# Altium schematic sheet FPGA_RGMII_Misc.SchDoc
size A3
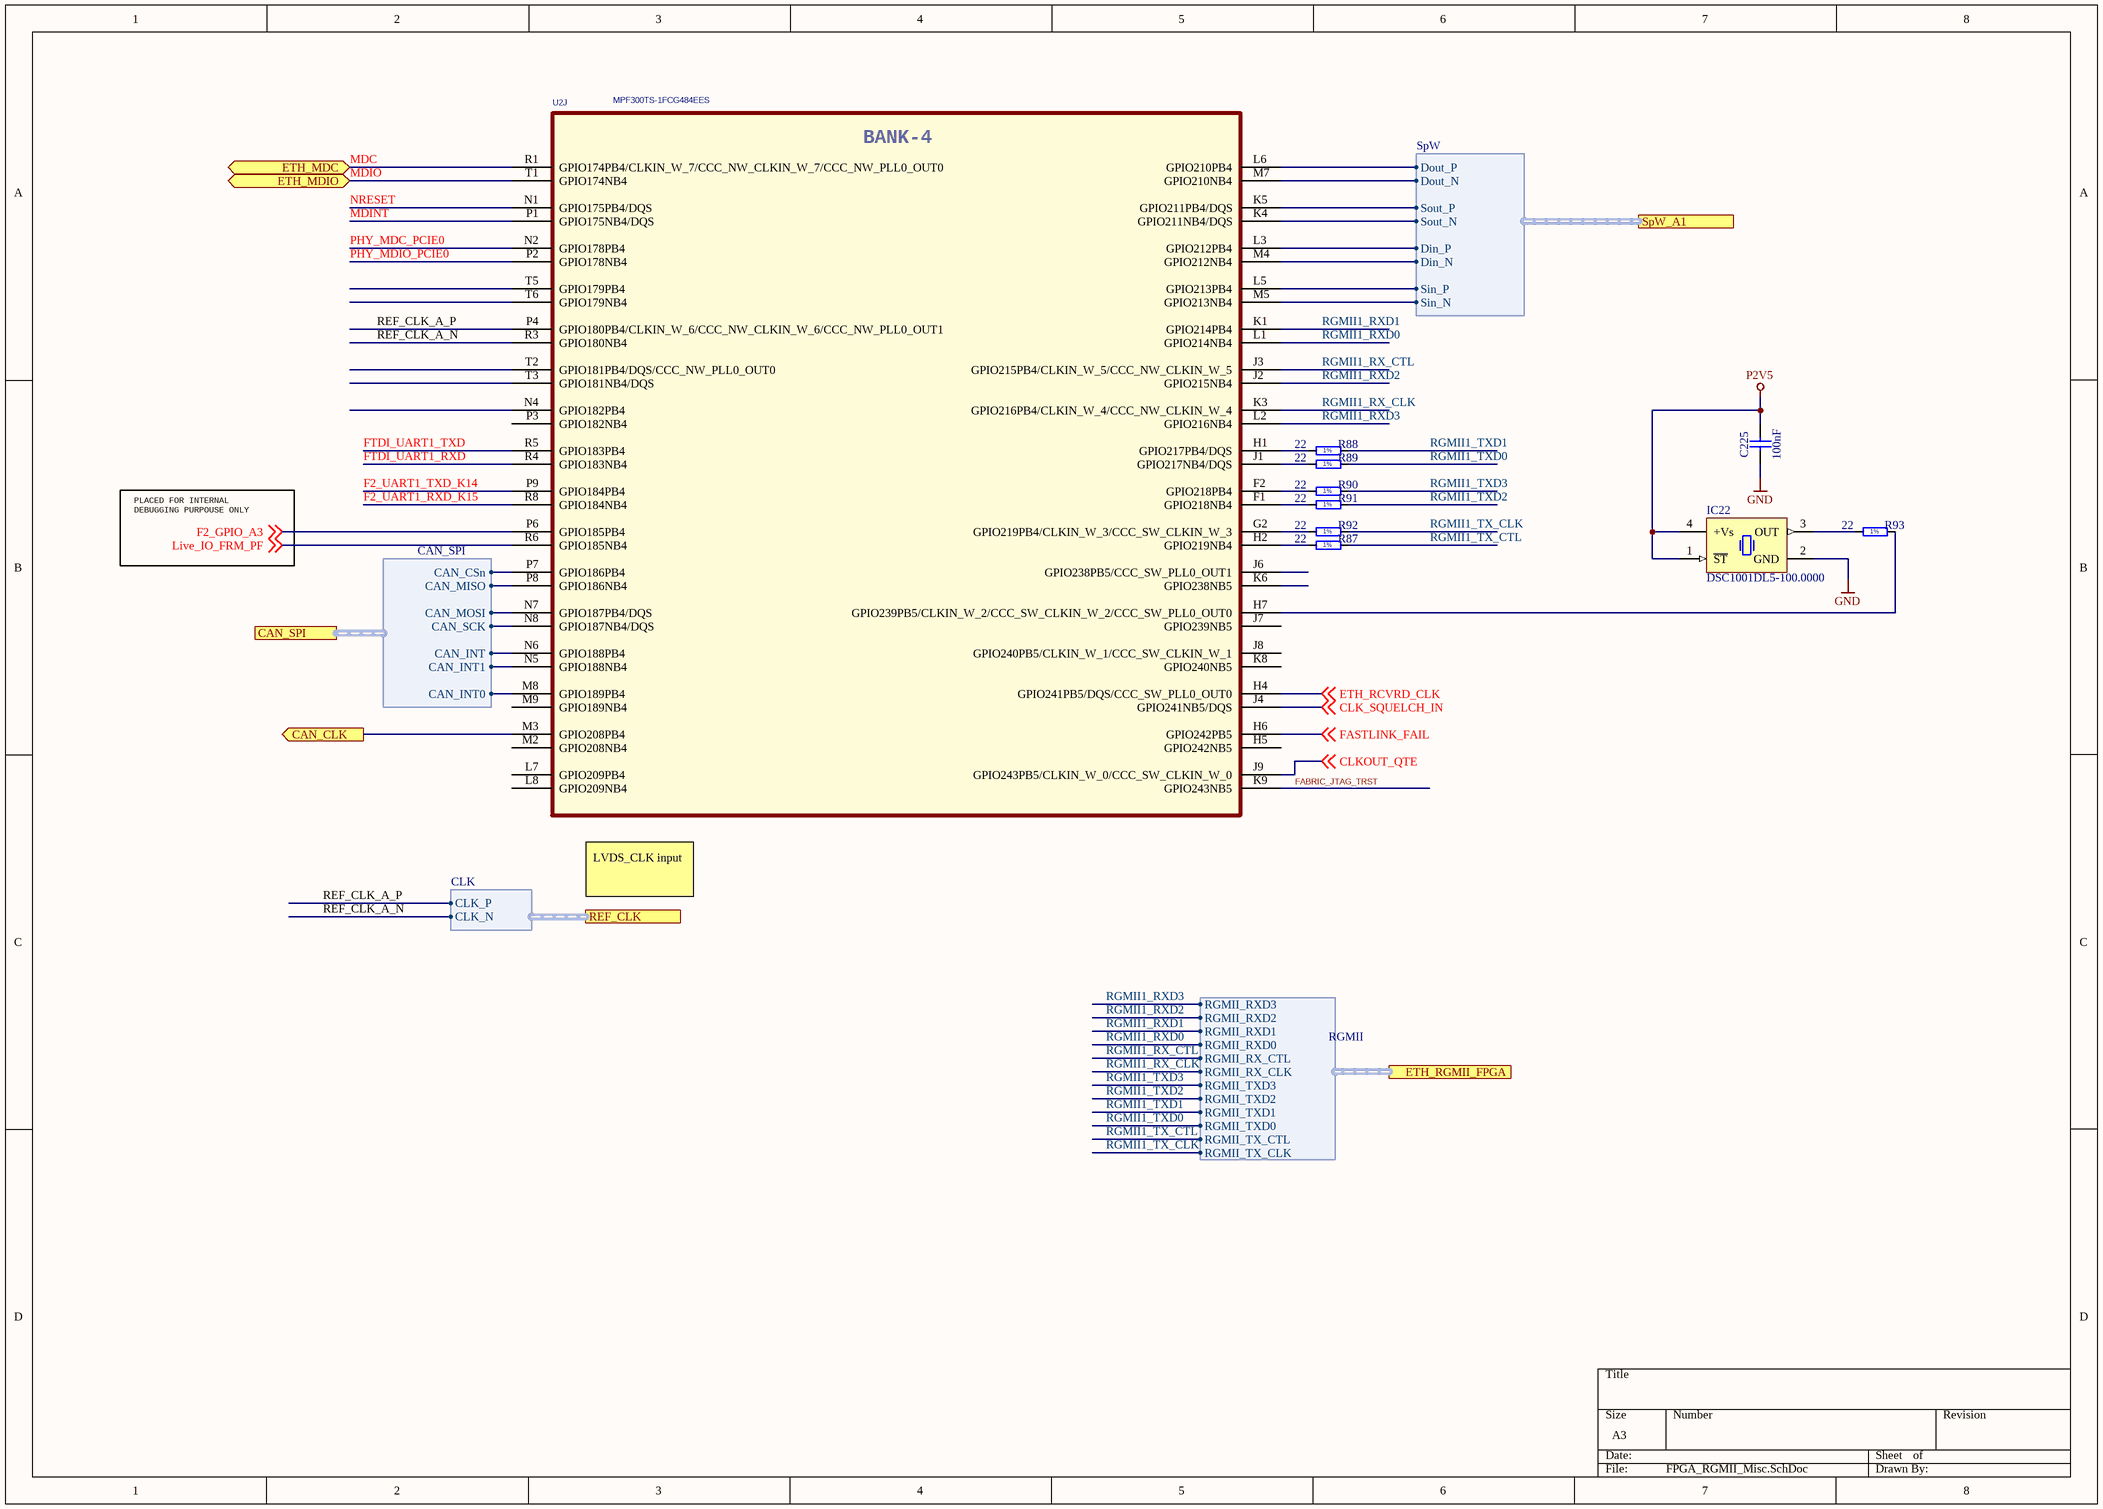
[diagram p0: FPGA_RGMII_Misc.SchDoc]

## Parts
C225  100nF  [CAPC0603X33N]
IC22  DSC1001DL5-100.0000  [OSC_MICREL_2520]
R87  22  [RESC1005X40N]
R88  22  [RESC1005X40N]
R89  22  [RESC1005X40N]
R90  22  [RESC1005X40N]
R91  22  [RESC1005X40N]
R92  22  [RESC1005X40N]
R93  22  [RESC1005X40N]
U2  MPF300TS-1FCG484EES  [BGA484C100P22X22_2300X2300X320]  (part J of 11)

## Ports
CAN_CLK (out), CAN_SPI (harness CAN_SPI), ETH_MDC (bidir), ETH_MDIO (bidir), ETH_RGMII_FPGA (harness RGMII), REF_CLK (harness CLK), SpW_A1 (harness SpW)

## Harnesses
RGMII: RGMII_RXD3, RGMII_RXD2, RGMII_RXD1, RGMII_RXD0, RGMII_RX_CTL, RGMII_RX_CLK, RGMII_TX_CLK, RGMII_TX_CTL, RGMII_TXD3, RGMII_TXD2, RGMII_TXD1, RGMII_TXD0
SpW: Sout_P, Sout_N, Dout_P, Dout_N, Sin_P, Sin_N, Din_P, Din_N
CLK: CLK_P, CLK_N
CAN_SPI: CAN_INT1, CAN_INT, CAN_INT0, CAN_SCK, CAN_MOSI, CAN_MISO, CAN_CSn

## Nets
GND: C225.1 IC22.2(GND)
P2V5: C225.2 IC22.1(~{ST}) IC22.4(+Vs)
CAN_CLK: U2.M3(GPIO208PB4) ; port CAN_CLK
CLK_SQUELCH_IN: U2.J4(GPIO241NB5/DQS) ; off-sheet CLK_SQUELCH_IN
CLKOUT_QTE: U2.J9(GPIO243PB5/CLKIN_W_0/CCC_SW_CLKIN_W_0) ; off-sheet CLKOUT_QTE
ETH_RCVRD_CLK: U2.H4(GPIO241PB5/DQS/CCC_SW_PLL0_OUT0) ; off-sheet ETH_RCVRD_CLK
F2_GPIO_A3: U2.P6(GPIO185PB4) ; off-sheet F2_GPIO_A3
F2_UART1_RXD_K15: U2.R8(GPIO184NB4)
F2_UART1_TXD_K14: U2.P9(GPIO184PB4)
FABRIC_JTAG_TRST: U2.K9(GPIO243NB5)
FASTLINK_FAIL: U2.H6(GPIO242PB5) ; off-sheet FASTLINK_FAIL
FTDI_UART1_RXD: U2.R4(GPIO183NB4)
FTDI_UART1_TXD: U2.R5(GPIO183PB4)
Live_IO_FRM_PF: U2.R6(GPIO185NB4) ; off-sheet Live_IO_FRM_PF
MDC: U2.R1(GPIO174PB4/CLKIN_W_7/CCC_NW_CLKIN_W_7/CCC_NW_PLL0_OUT0) ; port ETH_MDC
MDINT: U2.P1(GPIO175NB4/DQS)
MDIO: U2.T1(GPIO174NB4) ; port ETH_MDIO
NRESET: U2.N1(GPIO175PB4/DQS)
PHY_MDC_PCIE0: U2.N2(GPIO178PB4)
PHY_MDIO_PCIE0: U2.P2(GPIO178NB4)
REF_CLK_A_N: U2.R3(GPIO180NB4) ; port REF_CLK.CLK_N
REF_CLK_A_P: U2.P4(GPIO180PB4/CLKIN_W_6/CCC_NW_CLKIN_W_6/CCC_NW_PLL0_OUT1) ; port REF_CLK.CLK_P
RGMII1_RX_CLK: U2.K3(GPIO216PB4/CLKIN_W_4/CCC_NW_CLKIN_W_4) ; port ETH_RGMII_FPGA.RGMII_RX_CLK
RGMII1_RX_CTL: U2.J3(GPIO215PB4/CLKIN_W_5/CCC_NW_CLKIN_W_5) ; port ETH_RGMII_FPGA.RGMII_RX_CTL
RGMII1_RXD0: U2.L1(GPIO214NB4) ; port ETH_RGMII_FPGA.RGMII_RXD0
RGMII1_RXD1: U2.K1(GPIO214PB4) ; port ETH_RGMII_FPGA.RGMII_RXD1
RGMII1_RXD2: U2.J2(GPIO215NB4) ; port ETH_RGMII_FPGA.RGMII_RXD2
RGMII1_RXD3: U2.L2(GPIO216NB4) ; port ETH_RGMII_FPGA.RGMII_RXD3
RGMII1_TX_CLK: R92.2 ; port ETH_RGMII_FPGA.RGMII_TX_CLK
RGMII1_TX_CTL: R87.2 ; port ETH_RGMII_FPGA.RGMII_TX_CTL
RGMII1_TXD0: R89.2 ; port ETH_RGMII_FPGA.RGMII_TXD0
RGMII1_TXD1: R88.2 ; port ETH_RGMII_FPGA.RGMII_TXD1
RGMII1_TXD2: R91.2 ; port ETH_RGMII_FPGA.RGMII_TXD2
RGMII1_TXD3: R90.2 ; port ETH_RGMII_FPGA.RGMII_TXD3
NetIC22_3: IC22.3(OUT) R93.1
NetR87_1: R87.1 U2.H2(GPIO219NB4)
NetR88_1: R88.1 U2.H1(GPIO217PB4/DQS)
NetR89_1: R89.1 U2.J1(GPIO217NB4/DQS)
NetR90_1: R90.1 U2.F2(GPIO218PB4)
NetR91_1: R91.1 U2.F1(GPIO218NB4)
NetR92_1: R92.1 U2.G2(GPIO219PB4/CLKIN_W_3/CCC_SW_CLKIN_W_3)
NetR93_2: R93.2 U2.H7(GPIO239PB5/CLKIN_W_2/CCC_SW_CLKIN_W_2/CCC_SW_PLL0_OUT0)
NetU2_K4: U2.K4(GPIO211NB4/DQS) ; port SpW_A1.Sout_N
NetU2_K5: U2.K5(GPIO211PB4/DQS) ; port SpW_A1.Sout_P
NetU2_L3: U2.L3(GPIO212PB4) ; port SpW_A1.Din_P
NetU2_L5: U2.L5(GPIO213PB4) ; port SpW_A1.Sin_P
NetU2_L6: U2.L6(GPIO210PB4) ; port SpW_A1.Dout_P
NetU2_M4: U2.M4(GPIO212NB4) ; port SpW_A1.Din_N
NetU2_M5: U2.M5(GPIO213NB4) ; port SpW_A1.Sin_N
NetU2_M7: U2.M7(GPIO210NB4) ; port SpW_A1.Dout_N
NetU2_M8: U2.M8(GPIO189PB4) ; port CAN_SPI.CAN_INT0
NetU2_N5: U2.N5(GPIO188NB4) ; port CAN_SPI.CAN_INT1
NetU2_N6: U2.N6(GPIO188PB4) ; port CAN_SPI.CAN_INT
NetU2_N7: U2.N7(GPIO187PB4/DQS) ; port CAN_SPI.CAN_MOSI
NetU2_N8: U2.N8(GPIO187NB4/DQS) ; port CAN_SPI.CAN_SCK
NetU2_P7: U2.P7(GPIO186PB4) ; port CAN_SPI.CAN_CSn
NetU2_P8: U2.P8(GPIO186NB4) ; port CAN_SPI.CAN_MISO

Not connected (* = marked no-connect by the designer): U2 H5(GPIO242NB5) J6(GPIO238PB5/CCC_SW_PLL0_OUT1) J7(GPIO239NB5) J8(GPIO240PB5/CLKIN_W_1/CCC_SW_CLKIN_W_1) K6(GPIO238NB5) K8(GPIO240NB5) L7(GPIO209PB4) L8(GPIO209NB4) M2(GPIO208NB4) M9(GPIO189NB4) N4(GPIO182PB4) P3(GPIO182NB4) T2(GPIO181PB4/DQS/CCC_NW_PLL0_OUT0) T3(GPIO181NB4/DQS) T5(GPIO179PB4) T6(GPIO179NB4)

## Notes on the sheet
- PLACED FOR INTERNAL
  DEBUGGING PURPOUSE ONLY
- LVDS_CLK input
- (in symbol FPGA_MPF300T-FCG484, part J) BANK-4
- (in symbol R0402_22R_1%_0.0625W_100PPM) 1%

## Library data of the parts
C225 = CC0201_100NF_6.3V_10%_X5R: Non-polarised capacitor; Manufacturer: GENERIC; Part Description: SMD Multilayer Chip Ceramic Capacitor; Manufacturer1 Part Number: 02016D104KAT2A; Voltage: 6.3V; TC: X5R; Tolerance: ±10%; Part Number: CC0201_100NF_6.3V_10%_X5R; Component Kind: Standard; Component Type: Standard; Pin Count: 2; Value: 100nF; Status: Not Recommended; Manufacturer Part Number: CC0201_100NF_6.3V_10%_X5R; Case: 0201; Mounted: Yes; Socket: No; SMD: Yes; Sense: No; Manufacturer1 Example: AVX; Manufacturer1 ComponentHeight: 0.33mm; HelpURL: \\cern.ch\dfs\Applications\Altium\Datasheets\CC0201_X5R_AVX.pdf; Author: CERN DEM JLC; CreateDate: 03/12/2007; LatestRevisionDate: 03/12/2007
IC22 = OSC_DSC1001DL5-100.0000: MEMS 100MHz oscillator; Manufacturer: Micrel; Part Description: MEMS Oscillator 100MHz; Bonding: No; PressFit: No; Case: *; Component Kind: Standard; Component Type: Standard; ComponentHeigth: *; CreateDate: 2018-01-01; Device: DSC1001DL5-100.0000; Footprint: *; HelpURL: *; LatestRevisionDate: 2018-01-01; Manufacturer Part Number: DSC1001DL5-100.0000; Mounted: Yes; PackageDescription: MICREL SMD Oscillator, QFN, 4 pins, 2.5mm x 2.0mm; Part Number: DSC1001DL5-100.0000; Pin Count: 4; Sense: No; SMD: Yes; Socket: No; Value: *
R87-R93 = R0402_22R_1%_0.0625W_100PPM: Resistor - 1%; Part Description: General Purpose Thick Film Chip Resistor; Manufacturer: GENERIC; Manufacturer1 Part Number: 232270672209L; TC: ±100ppm/°C; PressFit: No; Part Number: R0402_22R_1%_0.0625W_100PPM; Component Kind: Standard; Component Type: Standard; Pin Count: 2; Value: 22; Status: Not Recommended; Power: 0.0625W; Tolerance: ±1%; Manufacturer Part Number: R0402_22R_1%_0.0625W_100PPM; Case: 0402; Mounted: Yes; Sense: No; Socket: No; SMD: Yes; Manufacturer1 Example: YAGEO PHYCOMP; Manufacturer1 ComponentHeight: 0.4mm; HelpURL: \\cern.ch\dfs\Applications\Altium\Datasheets\R0402_Phycomp_RC0402.pdf; Author: CERN DEM JLC; CreateDate: 03/12/2007; LatestRevisionDate: 17/10/2012
U2 = FPGA_MPF300T-FCG484: FCG484,23mmX23mm,1.0mm pitch; Manufacturer: Microsemi; Part Number: MPF300TS-1FCG484I